# Altium project OTHERTEST.PrjPcb
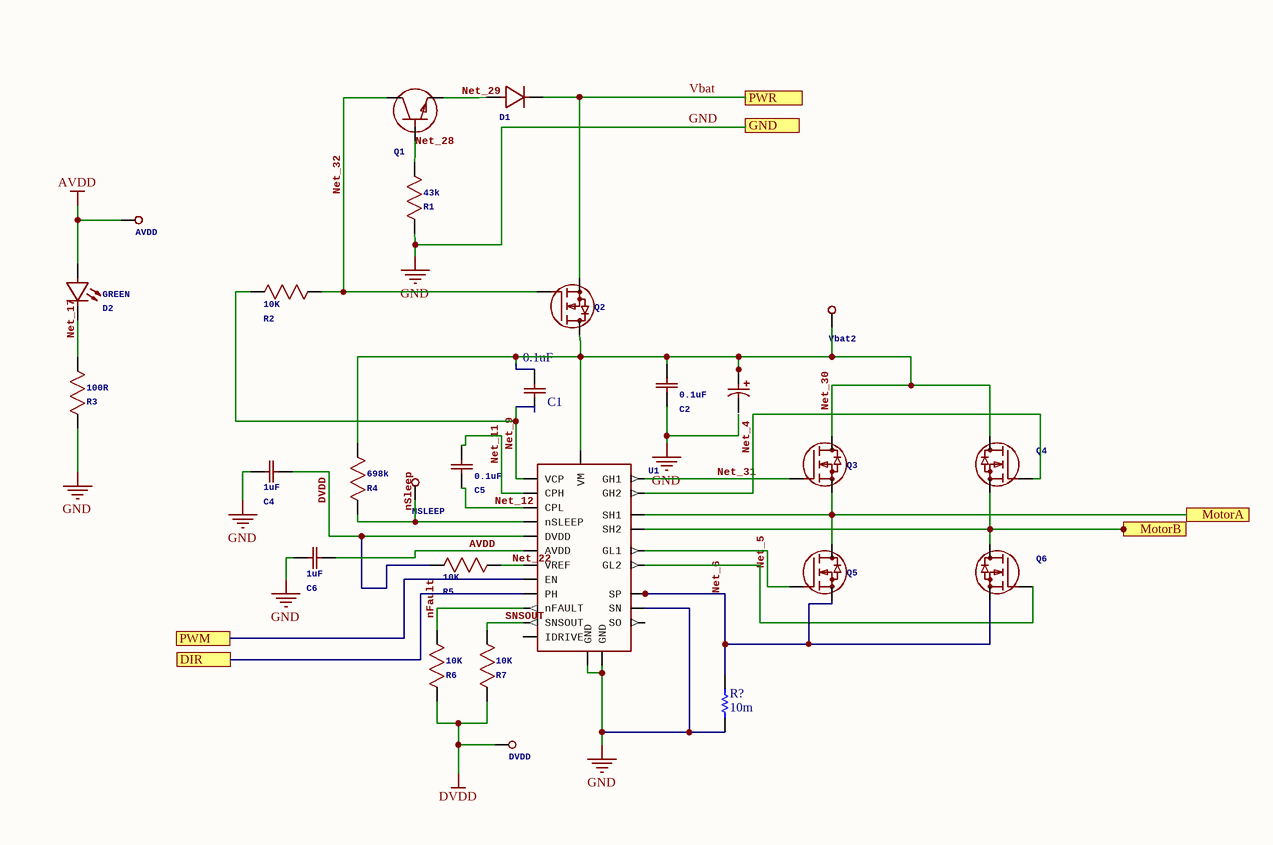
[diagram p0: OTHERTEST_0.SchDoc]
2 sheets, 42 parts. Net scope: flat (ports and power ports of the same name join across sheets).
Board file: PCB1.PcbDoc
Sheets:
  OTHERTEST_0.SchDoc
  OTHERTEST_1.SchDoc

## Sheet OTHERTEST_0.SchDoc
size 223 x 145 mm

### Parts
AVDD  NAME: AVDD  [TESTPAD_1.5mm]  (hidden comment: TESTPOINT)
C1  0.1uF  [CAP_0603_5]
C2  0.1uF  NAME: C2  [CAP_0603]
C3  1000uF  [CAPPR-2/4h6.8]  (value not drawn)
C4  1uF  NAME: C4  [CAP_0603]
C5  0.1uF  NAME: C5  [CAP_0603]
C6  1uF  NAME: C6  [CAP_0603]
D1  NAME: D1  [SOD-123]  (hidden comment: BAS16GW)
D2  GREEN  NAME: D2  [RES_0805]
DVDD  NAME: DVDD  [TESTPAD_1.5mm]  (hidden comment: TESTPOINT)
NSLEEP  NAME: NSLEEP  [TESTPAD_1.5mm]  (hidden comment: TESTPOINT)
Q1  NAME: Q1  [SOT23]  (hidden comment: NPN_40V_100MA)
Q2  NAME: Q2  [D2Pak_nexperia]  (hidden comment: NMOS_40V_75A)
Q3  NAME: Q3  [D2Pak_nexperia]  (hidden comment: NMOS_40V_75A_3)
Q4  NAME: Q4  [D2Pak_nexperia]  (hidden comment: NMOS_40V_75A_4)
Q5  NAME: Q5  [D2Pak_nexperia]  (hidden comment: NMOS_40V_75A_3)
Q6  NAME: Q6  [D2Pak_nexperia]  (hidden comment: NMOS_40V_75A_4)
R1  43k  NAME: R1  [RES_0603]
R2  10K  NAME: R2  [RES_0603]
R3  100R  NAME: R3  [RES_0603]
R4  698k  NAME: R4  [RES_0603]
R5  10K  NAME: R5  [RES_0603]
R6  10K  NAME: R6  [RES_0603]
R7  10K  NAME: R7  [RES_0603]
R?  value 10m  [STAC-CSS2725-099H_V]  (hidden comment: RES_10m_2728)
U1  NAME: U1  [QFN-24RV/4x4x0.5]  (hidden comment: DRV8701E)
Vbat2  NAME: Vbat2  [TESTPAD_1.5mm]  (hidden comment: TESTPOINT)

### Ports
DIR, GND, MotorA, MotorB, PWM, PWR

### Nets
AVDD: AVDD.1 C6.2 D2.1(A) U1.7(AVDD)
DVDD: C4.1 DVDD.1 R5.1 R6.2 R7.2 U1.8(DVDD)
GND: C2.2 C4.2 C6.1 R1.1 R3.1 R?.2 U1.5(GND) U1.16(GND) U1.20(SN) ; port GND
Net_4: Q4.1(G) U1.24(GH2)
Net_5: Q5.1(G) U1.19(GL1)
Net_6: Q5.3(S) Q6.3(S) R?.1 U1.21(SP)
Net_9: C1.1 R2.1 U1.2(VCP)
Net_11: C5.2 U1.3(CPH)
Net_12: C5.1 U1.4(CPL)
Net_17: D2.2(K) R3.2
Net_22: R5.2 U1.6(VREF)
Net_28: Q1.1(B) R1.2
Net_29: D1.2(A) Q1.2(E)
Net_30: C1.2 C2.1 C3.2(PLUS) Q2.2(D) Q3.2(D) Q4.2(D) R4.1 U1.1(VM) Vbat2.1
Net_31: Q3.1(G) U1.17(GH1)
Net_32: Q1.3(C) Q2.1(G) R2.2
nFault: R6.1 U1.9(nFAULT)
nSleep: NSLEEP.1 R4.2 U1.13(nSLEEP)
SNSOUT: R7.1 U1.10(SNSOUT)
Vbat: D1.1(K) Q2.3(S) ; port PWR
Net?#1_4: U1.14(EN) ; port PWM
Net?#2_4: U1.15(PH) ; port DIR
NetJ2_1: Q3.3(S) Q5.2(D) U1.18(SH1) ; port MotorA
NetJ2_2: Q4.3(S) Q6.2(D) U1.23(SH2) ; port MotorB
NetQ6_1: Q6.1(G) U1.22(GL2)

Not connected (* = marked no-connect by the designer): C3 1(MINUS); U1 11(SO) 12(IDRIVE)

### Library data of the parts
AVDD DVDD NSLEEP Vbat2 = TESTPOINT: GateName_1: PART_1; SymbolName_1: TESTPOINT; LibraryName: common; DeviceSetName: TESTPOINT
C1 = CAP_0.1UF_35V_0603: MANUFACTURER: Taiyo Yuden; MPN: GMK107B7104KAHT; GateName_1: PART_1; SymbolName_1: CAP_NONPOLARIZED; VOLTAGE: 35V; LibraryName: OTHERTEST; DeviceSetName: CAP_0.1UF_35V_0603; Package: CAP_0603_5
C2 C5 = CAP_0.1UF_0603: MANUFACTURER: Taiyo Yuden; MPN: GMK107B7104KAHT; GateName_1: PART_1; VOLTAGE: 35V; SymbolName_1: CAP_0.1UF_0603; LibraryName: common; DeviceSetName: CAP_0.1UF_0603
C3 = CAP_22UF_POL: MANUFACTURER: Wurth Electronics Inc; MPN: 860020672011; GateName_1: PART_1; ATTR_1: Electrolytic; SymbolName_1: CAP_22UF_POL; LibraryName: OTHERTEST; DeviceSetName: CAP_22UF_POL; DATASHEET: http://katalog.we-online.de/pbs/datasheet/860020672011.pdf; Package: CAPPR-2/4h6.8
C4 C6 = CAP_1UF_0603: MANUFACTURER: Yageo; MPN: CC0603ZRY5V7BB105; GateName_1: PART_1; SymbolName_1: CAP_1UF_0603; LibraryName: common; DeviceSetName: CAP_1UF_0603
D1 = BAS16GW: MANUFACTURER: Nexperia; GateName_1: PART_1; SymbolName_1: BAS16GW; LibraryName: common; DeviceSetName: BAS16GW; DATASHEET: https://assets.nexperia.com/documents/data-sheet/BAS16GW.pdf; MPN: BAS16GW
D2 = DIO_LED_G: MANUFACTURER: OSRAM; MPN: LG R971-KN-1; GateName_1: PART_1; SymbolName_1: DIO_LED_G; LibraryName: common; DeviceSetName: DIO_LED_G
Q1 = NPN_40V_100MA: MANUFACTURER: Micro Commercial Co; MPN: MMBT3904-TP; GateName_1: PART_1; SymbolName_1: NPN_40V_100MA; LibraryName: common; DeviceSetName: NPN_40V_100MA; DATASHEET: http://www.mccsemi.com/up_pdf/MMBT3904(SOT-23).pdf
Q2 = NMOS_40V_75A: MANUFACTURER: Nexperia; MPN: BUK768R1-40E; GateName_1: PART_1; SymbolName_1: NMOS_40V_75A; LibraryName: common; DeviceSetName: NMOS_40V_75A; DATASHEET: https://assets.nexperia.com/documents/data-sheet/BUK765R3-40E.pdf
Q3 Q5 = NMOS_40V_75A_3: MANUFACTURER: Nexperia; MPN: BUK768R1-40E; GateName_1: PART_1; SymbolName_1: NMOS_40V_75A_3_0; LibraryName: common; DeviceSetName: NMOS_40V_75A_3; DATASHEET: https://assets.nexperia.com/documents/data-sheet/BUK765R3-40E.pdf
Q4 Q6 = NMOS_40V_75A_4: MANUFACTURER: Nexperia; MPN: BUK768R1-40E; GateName_1: PART_1; SymbolName_1: NMOS_40V_75A_4_0; LibraryName: common; DeviceSetName: NMOS_40V_75A_4; DATASHEET: https://assets.nexperia.com/documents/data-sheet/BUK765R3-40E.pdf
R1 = RES_43K_0603: MANUFACTURER: Yageo; MPN: RC0603JR-0743KL; GateName_1: PART_1; SymbolName_1: RES_43K_0603; LibraryName: common; DeviceSetName: RES_43K_0603; DATASHEET: https://medhttp://www.yageo.com/documents/recent/PYu-RC_Group_51_RoHS_L_8.pdf
R2 R5-R7 = RES_10K_0603: MANUFACTURER: Yageo; MPN: RC0603JR-0710KL; GateName_1: PART_1; SymbolName_1: RES_10K_0603; LibraryName: common; DeviceSetName: RES_10K_0603
R3 = RES_100R_0603: MANUFACTURER: Yageo; MPN: RC0603FR-07100RL; GateName_1: PART_1; SymbolName_1: RES_100R_0603; LibraryName: common; DeviceSetName: RES_100R_0603
R4 = RES_698K_0603: MANUFACTURER: Yageo; MPN: RC0603FR-07698KL; GateName_1: PART_1; SymbolName_1: RES_698K_0603; LibraryName: common; DeviceSetName: RES_698K_0603; DATASHEET: http://www.yageo.com/documents/recent/PYu-RC_Group_51_RoHS_L_8.pdf
R? = RES_10m_2728: RES SMD 10mOHM 1% 4W 2728; Manufacturer: Yageo; Part Number (MPN): RC0603FR-07698KL; Package: 0603 (1608 Metric); Dimensions: 0.063" L x 0.031" W (1.60mm x 0.80mm); Tolerance: 1%; Supplier 1: Digi-Key; Supplier Part Number 1: CSSH2728FT10L0DKR-ND
U1 = DRV8701E: MANUFACTURER: Texas Instruments; MPN: DRV8701ERGET; GateName_1: PART_1; SymbolName_1: DRV8701E; LibraryName: common; DeviceSetName: DRV8701E

## Sheet OTHERTEST_1.SchDoc
size 228 x 144 mm
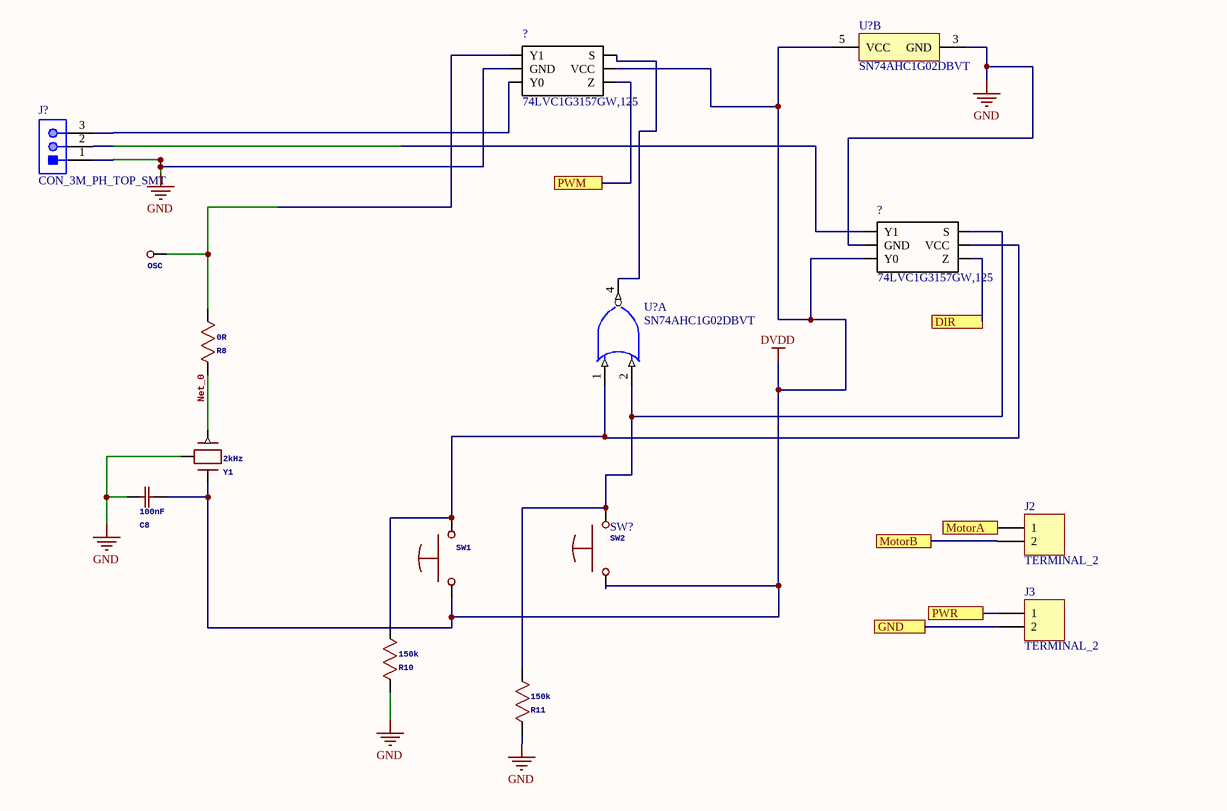
[diagram p1: OTHERTEST_1.SchDoc]

### Parts
(Parts that share a designator on the sheet are numbered #1, #2 ... from top to bottom, then left to right.)
?#1  74LVC1G3157GW,125  [SOT363]
?#2  74LVC1G3157GW,125  [SOT363]
C8  100nF  NAME: C8  [CAP_0603]
J2  TERMINAL_2  [OSTYK51102030]
J3  TERMINAL_2  [OSTYK51102030]
J?  CON_3M_PH_TOP_SMT  [JST-B3B-SM4-TB]
OSC  NAME: OSC  [TESTPAD_1.5mm]  (hidden comment: TESTPOINT)
R8  0R  NAME: R8  [RES_0603]
R10  150k  NAME: R10  [RES_0603]
R11  150k  NAME: R11  [RES_0603]
SW2  NAME: SW1  [PUSHBUTTON_RECTANGLE]  (hidden comment: PUSHBUTTON_TACTILE)
SW?  NAME: SW2  [PUSHBUTTON_RECTANGLE]  (hidden comment: PUSHBUTTON_TACTILE)
U?#1  SN74AHC1G02DBVT  [DBV0005A_N]  (part B of 2)
U?#2  SN74AHC1G02DBVT  [DBV0005A_N]  (part A of 2)
Y1  2kHz  NAME: Y1  [4_lead_CDFN3225]

### Ports
DIR, GND, MotorA, MotorB, PWM, PWR

### Nets
DVDD: ?#1.5(VCC) ?#2.3(Y0) C8.1 SW2.1(C1) SW?.1(C1) U?#1.5(VCC) Y1.4(VDD)
GND: ?#1.2(GND) ?#2.2(GND) C8.2 J3.2 J?.1 R10.2 R11.2 U?#1.3(GND) Y1.2(GND) ; port GND
Net_0: R8.1 Y1.1(OUT)
Vbat: J3.1 ; port PWR
Net?#1_1: ?#1.1(Y1) OSC.1 R8.2
Net?#1_3: ?#1.3(Y0) J?.3
Net?#1_4: ?#1.4(Z) ; port PWM
Net?#1_6: ?#1.6(S) U?#2.4(Y)
Net?#2_1: ?#2.1(Y1) J?.2
Net?#2_4: ?#2.4(Z) ; port DIR
Net?#2_5: ?#2.5(VCC) R10.1 SW2.2(C2) U?#2.1(A)
Net?#2_6: ?#2.6(S) R11.1 SW?.2(C2) U?#2.2(B)
NetJ2_1: J2.1 ; port MotorA
NetJ2_2: J2.2 ; port MotorB

### Library data of the parts
?#1 ?#2 = 74LVC1G3157GW,125: 74LVC1G3157 - 2-channel analog multiplexer/demultiplexer; MF: Nexperia USA; SnapEDA_Link: https://www.snapeda.com/parts/74LVC1G3157GW%2C125/Nexperia%20USA%20Inc./view-part/?ref=snap; Availability: Unavailable; Price: None; MP: 74LVC1G3157GW,125; Package: SOT-363 Nexperia; Value: *
C8 = CAP_100NF_0603: MANUFACTURER: Yageo; MPN: CC0603KRX7R7BB104; GateName_1: PART_1; SymbolName_1: CAP_100NF_0603; LibraryName: common; DeviceSetName: CAP_100NF_0603
J2 J3 = TERMINAL_2: Header, 2-Pin; LatestRevisionDate: 17-Jul-2002; LatestRevisionNote: Re-released for DXP Platform.; Publisher: Altium Limited
J? = CON_3M_PH_TOP_SMT: CONN HEADER PH TOP 3POS 2MM SMD; Manufacturer: JST; Part Number: B3B-PH-SM4-TB; ComponentLink1Description: Datasheet; ComponentLink1URL: http://www.jst-mfg.com/product/pdf/eng/ePH.pdf
OSC = TESTPOINT: GateName_1: PART_1; SymbolName_1: TESTPOINT; LibraryName: common; DeviceSetName: TESTPOINT
R8 = RES_0R_0603: MANUFACTURER: Yageo; MPN: RC0603JR-070RL; GateName_1: PART_1; SymbolName_1: RES_0R_0603; LibraryName: common; DeviceSetName: RES_0R_0603
R10 R11 = RES_150K_0603: MANUFACTURER: Yageo; MPN: RC0603JR-07150KL; GateName_1: PART_1; SymbolName_1: RES_150K_0603; LibraryName: common; DeviceSetName: RES_150K_0603; DATASHEET: http://www.yageo.com/documents/recent/PYu-RC_Group_51_RoHS_L_8.pdf
SW2 SW? = PUSHBUTTON_TACTILE: MANUFACTURER: C&K; MPN: RS-282G05A3-SM RT; GateName_1: PART_1; ATTR_1: Normally Open; SymbolName_1: PUSHBUTTON_TACTILE; LibraryName: common; DeviceSetName: PUSHBUTTON_TACTILE
U?#1 U?#2 = SN74AHC1G02DBVT: Single 2-Input Positive-NOR Gate, DBV0005A, SMALL T&R; Manufacturer: Texas Instruments; VCC(Min)(V): 2; VCC(Max)(V): 5.5; Output Type: CMOS; ICC @ Nom Voltage(Max)(mA): 0.01; Bits(#): 1; F @ Nom Voltage(Max)(Mhz): 75; Rating: Catalog; Technology Family: AHC; Voltage(Nom)(V): 3.3,5; Schmitt Trigger: No; Output Drive (IOL/IOH)(Max)(mA): 50/-50; tpd @ Nom Voltage(Max)(ns): 11.4,7.5; Logic: True; Gate Type: NOR; Sub-Family: NAND Gate; DatasheetVersion: SCLS342M; PackageReference: DBV0005A; Supplier 1: Mouser; Supplier Part Number 1: 595-SN74AHC1G02DBVT; Supplier 2: Digi-Key; Supplier Part Number 2: SN74AHC1G02DBVT-ND; Generic Part Number: SN74AHC1G02; Input Type: CMOS; Operating Temperature Range(C): -40 to 125,-40 to 85; 3-State Output: No; PartNumber: SN74AHC1G02DBVT; ComponentLink1Description: Manufacturer URL; ComponentLink1URL: http://www.ti.com/; ComponentLink2Description: Datasheet; ComponentLink2URL: http://www.ti.com/lit/ds/symlink/sn74ahc1g02.pdf
Y1 = OSCILLATOR_2KHZ: MANUFACTURER: Microchip Technology; MPN: DSC6083CI2A-002K000; GateName_1: PART_1; SymbolName_1: OSCILLATOR_2KHZ; LibraryName: common; DeviceSetName: OSCILLATOR_2KHZ; DATASHEET: http://ww1.microchip.com/downloads/en/DeviceDoc/20005625B.pdf

## Nets that join several sheets
DVDD: OTHERTEST_0 (6 pins), OTHERTEST_1 (7 pins)
GND: OTHERTEST_0 (9 pins), OTHERTEST_1 (9 pins)
Net?#1_4: OTHERTEST_0 (U1.14), OTHERTEST_1 (?#1.4)
Net?#2_4: OTHERTEST_0 (U1.15), OTHERTEST_1 (?#2.4)
NetJ2_1: OTHERTEST_0 (Q3.3 Q5.2 U1.18), OTHERTEST_1 (J2.1)
NetJ2_2: OTHERTEST_0 (Q4.3 Q6.2 U1.23), OTHERTEST_1 (J2.2)
Vbat: OTHERTEST_0 (D1.1 Q2.3), OTHERTEST_1 (J3.1)